# EAGLE design jacarerele (EAGLE 6.5.0)
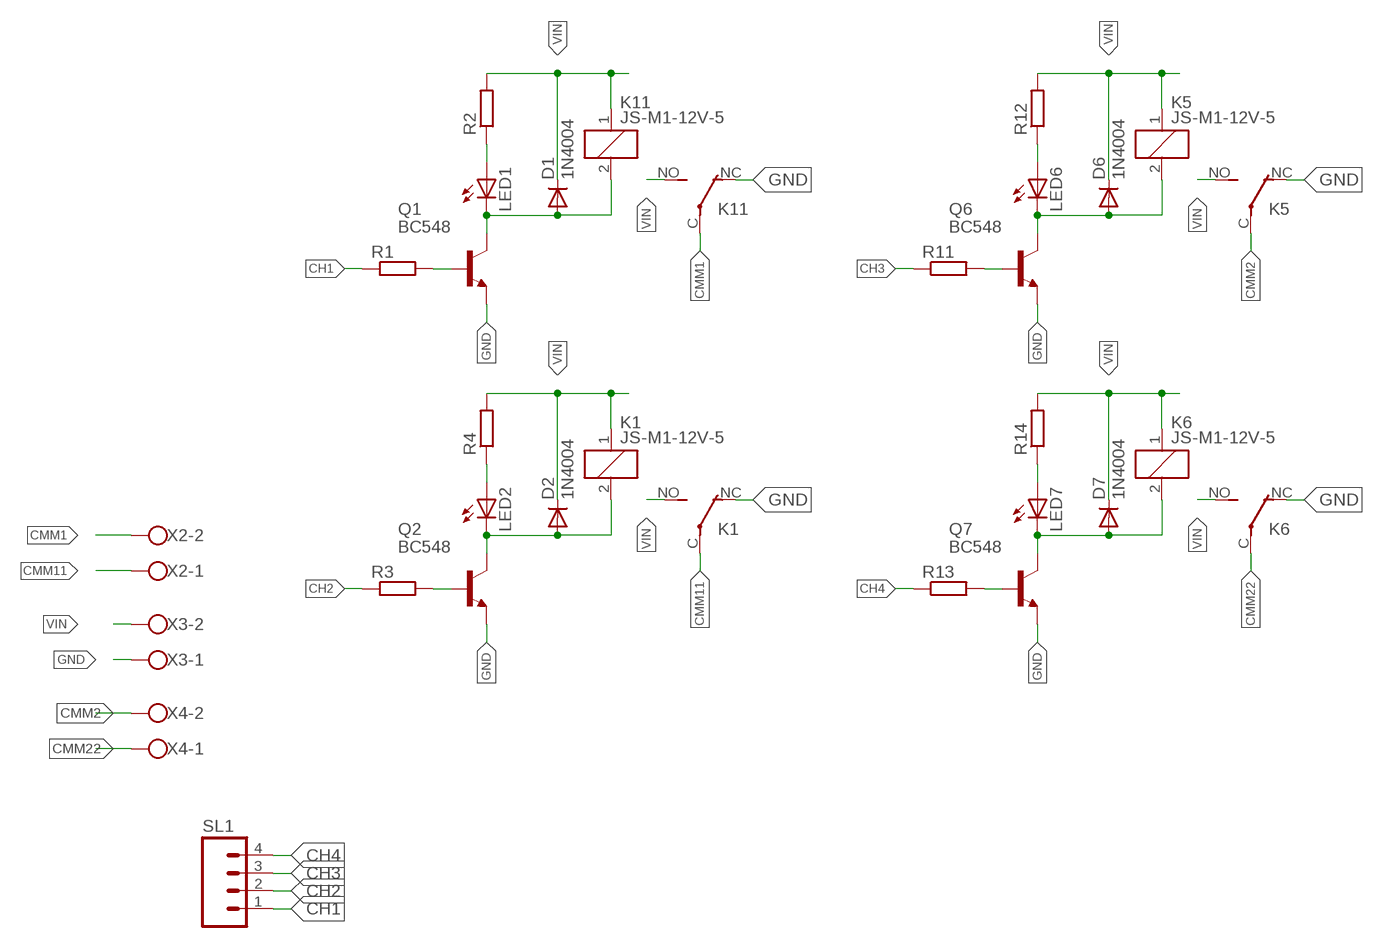
[diagram p0: schematic, sheet 1]

## Parts
D1  1N4004  [DO41-10]
D2  1N4004  [DO41-10]
D6  1N4004  [DO41-10]
D7  1N4004  [DO41-10]
K1  JS-M1-12V-5  [JS-M]
K5  JS-M1-12V-5  [JS-M]
K6  JS-M1-12V-5  [JS-M]
K11  JS-M1-12V-5  [JS-M]
LED1  LED5MM  [LED5MM]
LED2  LED5MM  [LED5MM]
LED6  LED5MM  [LED5MM]
LED7  LED5MM  [LED5MM]
Q1  BC548  [TO92-EBC]
Q2  BC548  [TO92-EBC]
Q6  BC548  [TO92-EBC]
Q7  BC548  [TO92-EBC]
R1  R-EU_0207/10  [0207/10]
R2  R-EU_0207/10  [0207/10]
R3  R-EU_0207/10  [0207/10]
R4  R-EU_0207/10  [0207/10]
R11  R-EU_0207/10  [0207/10]
R12  R-EU_0207/10  [0207/10]
R13  R-EU_0207/10  [0207/10]
R14  R-EU_0207/10  [0207/10]
SL1  MA04  [04PA]
X2  W237-102  [W237-102]
X3  W237-102  [W237-102]
X4  W237-102  [W237-102]

## Nets
CH1: R1.1 SL1.1
CH2: R3.1 SL1.2
CH3: R11.1 SL1.3
CH4: R13.1 SL1.4
CMM1: K11.C(2:P) X2.2
CMM2: K5.C(2:P) X4.2
CMM11: K1.C(2:P) X2.1
CMM22: K6.C(2:P) X4.1
GND: K1.NC(2:O) K5.NC(2:O) K6.NC(2:O) K11.NC(2:O) Q1.E Q2.E Q6.E Q7.E X3.1
N$1: Q1.B R1.2
N$2: LED1.A R2.1
N$3: Q2.B R3.2
N$4: LED2.A R4.1
N$5: D1.A K11.2 LED1.K(C) Q1.C
N$6: D2.A K1.2 LED2.K(C) Q2.C
N$16: Q6.B R11.2
N$17: LED6.A R12.1
N$18: D6.A K5.2 LED6.K(C) Q6.C
N$19: Q7.B R13.2
N$20: LED7.A R14.1
N$21: D7.A K6.2 LED7.K(C) Q7.C
VIN: D1.C D2.C D6.C D7.C K1.1 K1.NO(2:S) K5.1 K5.NO(2:S) K6.1 K6.NO(2:S) K11.1 K11.NO(2:S) R2.2 R4.2 R12.2 R14.2 X3.2

## Library data of the parts
D1 D2 D6 D7 = diode:1N4004: DIODE general purpose rectifier, 1 A
K1 K5 K6 K11 = relay:JS-M1*: Automotive Ultra-Miniature Power Relay NAiS Source: http://www.mew-europe.com/.. en_ds_61211_0000.pdf; MF: FARNELL; MPN: JSM1-12V-5; OC_FARNELL: 910351; OC_NEWARK: 14J1764
LED1 LED2 LED6 LED7 = led:LED: LED OSRAM: - CHIPLED LG R971, LG N971, LY N971, LG Q971, LY Q971, LO R971, LY R971 LH N974, LH R974 LS Q976, LO Q976, LY Q976 LO Q996 - Hyper CHIPLED LW Q18S LB Q993, LB Q99A, LB R99A - SideLED LS A670, LO A670, LY A670, LG A670, LP A670 LB A673, LV A673, LT A673, LW A673 LH A674 LY A675 LS A676, LA A676, LO A676, LY A676, LW A676 LS A679, LY A679, LG A679 - Hyper Micro SIDELED® LS Y876, LA Y876, LO Y876, LY Y876 LT Y87S - SmartLED LW L88C, LW L88S LB L89C, LB L89S, LG L890 LS L89K, LO L89K, LY L89K LS L896, LA L896, LO L896, LY L896 - TOPLED LS T670, LO T670, LY T670, LG T670, LP T670 LSG T670, LSP T670, LSY T670, LOP T670, LYG T670 LG T671, LOG T671, LSG T671 LB T673, LV T673, LT T673, LW T673 LH T674 LS T676, LA T676, LO T676, LY T676, LB T676, LH T676, LSB T676, LW T676 LB T67C, LV T67C, LT T67C, LS T67K, LO T67K, LY T67K, LW E67C LS E67B, LA E67B, LO E67B, LY E67B, LB E67C, LV E67C, LT E67C LW T67C LS T679, LY T679, LG T679 LS T770, LO T770, LY T770, LG T770, LP T770 LB T773, LV T773, LT T773, LW T773 LH T774 LS E675, LA E675, LY E675, LS T675 LS T776, LA T776, LO T776, LY T776, LB T776 LHGB T686 LT T68C, LB T68C - Hyper Mini TOPLED® LB M676 - Mini TOPLED Santana® LG M470 LS M47K, LO M47K, LY M47K Source: http://www.osram.convergy.de LUXEON: - LUMILED® LXK2-PW12-R00, LXK2-PW12-S00, LXK2-PW14-U00, LXK2-PW14-V00 LXK2-PM12-R00, LXK2-PM12-S00, LXK2-PM14-U00 LXK2-PE12-Q00, LXK2-PE12-R00, LXK2-PE12-S00, LXK2-PE14-T00, LXK2-PE14-U00 LXK2-PB12-K00, LXK2-PB12-L00, LXK2-PB12-M00, LXK2-PB14-N00, LXK2-PB14-P00, LXK2-PB14-Q00 LXK2-PR12-L00, LXK2-PR12-M00, LXK2-PR14-Q00, LXK2-PR14-R00 LXK2-PD12-Q00, LXK2-PD12-R00, LXK2-PD12-S00 LXK2-PH12-R00, LXK2-PH12-S00 LXK2-PL12-P00, LXK2-PL12-Q00, LXK2-PL12-R00 Source: www.luxeon.com KINGBRIGHT: KA-3528ASYC Source: www.kingbright.com
Q1 Q2 Q6 Q7 = transistor-npn:BC548*: NPN Transistor
R1-R4 R11-R14 = rcl:R-EU_: RESISTOR, European symbol
SL1 = con-amp-quick:MA04: AMP QUICK CONNECTOR; OC_FARNELL: unknown; OC_NEWARK: unknown
X2-X4 = con-wago-500:W237-102: WAGO SCREW CLAMP; MPN: 237-102; OC_FARNELL: unknown; OC_NEWARK: 70K9898

## Board
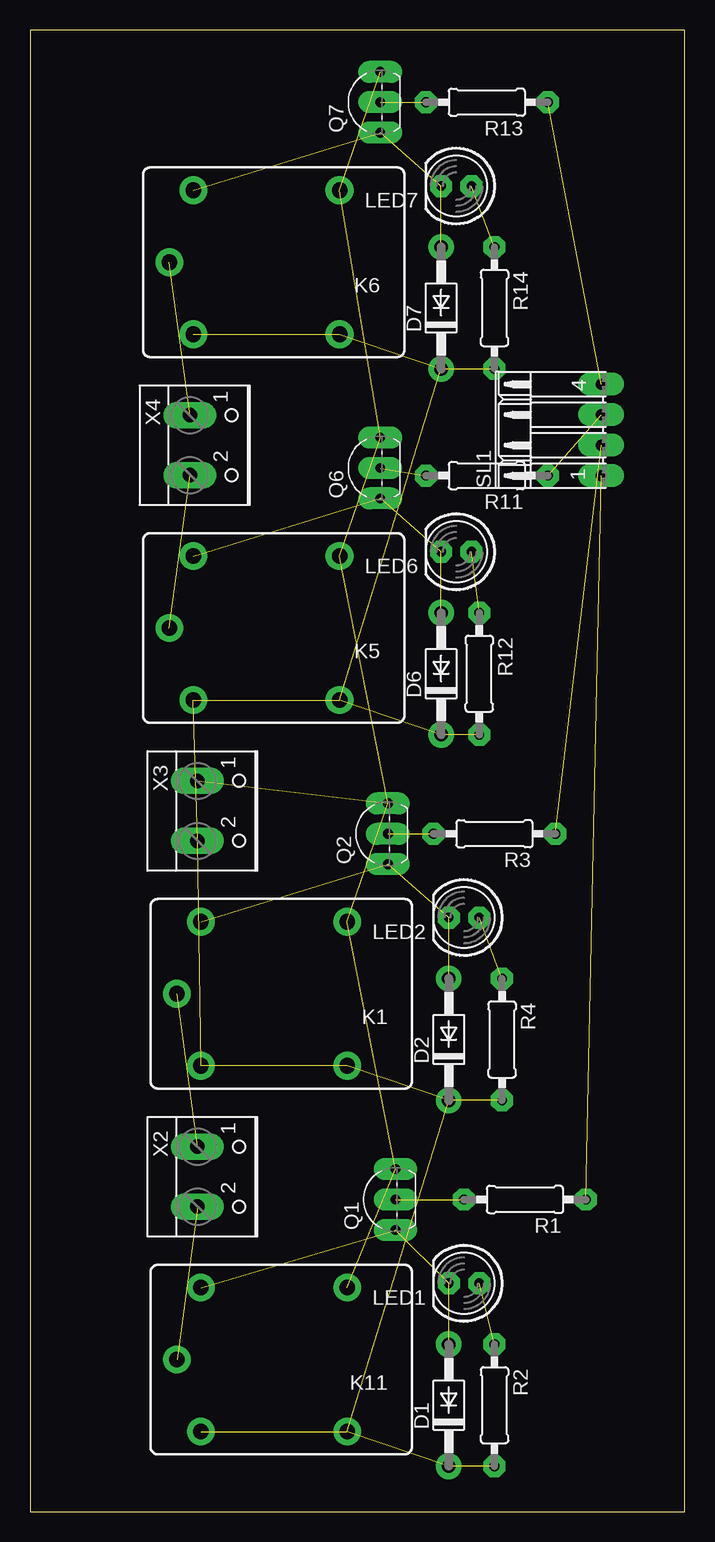
[diagram p1: board, top side]
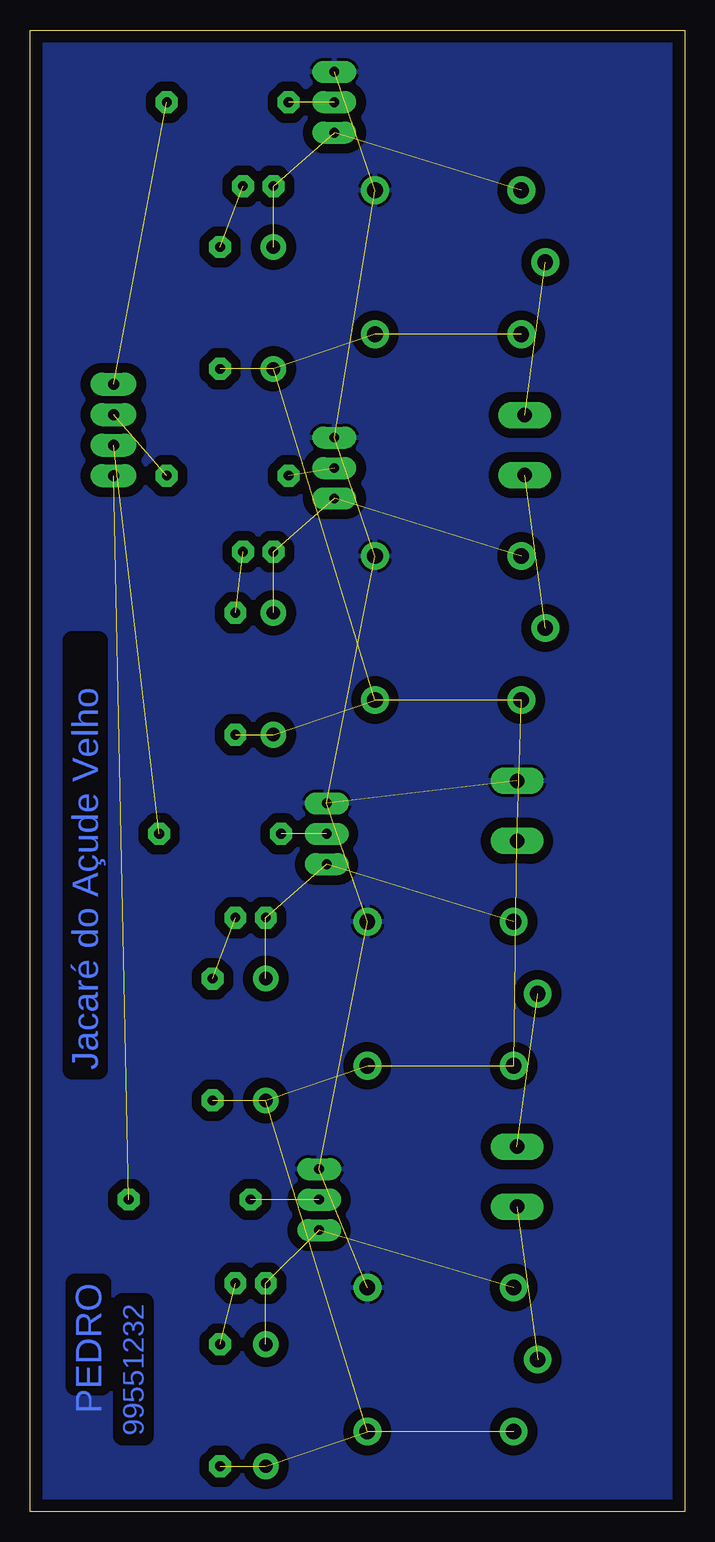
[diagram p2: board, bottom side, seen from below]

Size 54.59 x 123.5 mm. Coordinates in mm from the lower left corner, seen from the top.
Outline: 0,0 54.59,0 54.59,123.5 0,123.5 0,0
Copper layers (1*16): Top 0.035mm / dielectric 1.5mm / Bottom 0.035mm
Design rules "default *": minimum track width 40mil, minimum drill 40mil, track to track 15mil, track to pad 15mil, pad to pad 15mil, via to via 15mil, smd to smd 10mil, copper to edge 40mil, drill to drill 8mil, minimum pad ring 20mil, minimum via ring 15mil, stop-mask expansion 4mil, vias tented up to drill 0mil, thermal gap 10mil

### Footprints (pad centres in the part's own frame; a part is rotated, then mirrored left to right if it is on the bottom)
DO41-10 = drill 1.118: A 5.08,0; C -5.08,0
JS-M = drill 1.3: 1 6.7,6; 2 6.7,-6; C 8.7,0; NC -5.5,-6; NO -5.5,6
LED5MM = drill 0.813 octagon: A -1.27,0; K 1.27,0
TO92-EBC = drill 0.813 long: B 0,-1.27; C -2.54,-1.27; E 2.54,-1.27
0207/10 = drill 0.813 octagon: 1 -5.08,0; 2 5.08,0
04PA = drill 0.914 long: 1 -3.81,0; 2 -1.27,0; 3 1.27,0; 4 3.81,0
W237-102 = drill 1.194 long: 1 -2.5,-1.27; 2 2.5,-1.27

### Placement (x,y rotation side)
D1  34.92,8.89 90 top
D2  34.92,39.37 90 top
D6  34.29,69.85 90 top
D7  34.29,100.33 90 top
K1  20.95,43.18 180 top
K5  20.32,73.66 180 top
K6  20.32,104.14 180 top
K11  20.95,12.7 180 top
LED1  36.2,19.05 180 top
LED2  36.2,49.53 180 top
LED6  35.56,80.01 180 top
LED7  35.56,110.49 180 top
Q1  29.21,26.03 90 top
Q2  28.57,56.52 90 top
Q6  27.94,87 90 top
Q7  27.94,117.47 90 top
R1  41.27,26.03 180 top
R2  38.73,8.89 270 top
R3  38.73,56.52 180 top
R4  39.37,39.37 270 top
R11  38.1,86.36 180 top
R12  37.47,69.85 270 top
R13  38.1,117.47 180 top
R14  38.73,100.33 270 top
SL1  47.62,90.17 90 top
X2  15.24,27.94 270 top
X3  15.24,58.42 270 top
X4  14.61,88.9 270 top

### Tracks (layer width: path | path; a pad name or v marks a point on that pad's centre or on a via)
CH1  (1 unrouted)
CH2  (1 unrouted)
CH3  (1 unrouted)
CH4  (1 unrouted)
CMM1  (1 unrouted)
CMM2  (1 unrouted)
CMM11  (1 unrouted)
CMM22  (1 unrouted)
GND  (8 unrouted)
  pour Bottom (isolate 0.813): 55.25,123.19 54.61,0 -1.9,-1.27 -1.27,123.82
N$1  (1 unrouted)
N$2  (1 unrouted)
N$3  (1 unrouted)
N$4  (1 unrouted)
N$5  (3 unrouted)
N$6  (3 unrouted)
N$16  (1 unrouted)
N$17  (1 unrouted)
N$18  (3 unrouted)
N$19  (1 unrouted)
N$20  (1 unrouted)
N$21  (3 unrouted)
VIN  (16 unrouted)

### Text on the board
Bottom: Jacaré do Açude Velho | PEDRO | 99551232